# EAGLE design audioshieldproto-r2-v1 (EAGLE 5.01)
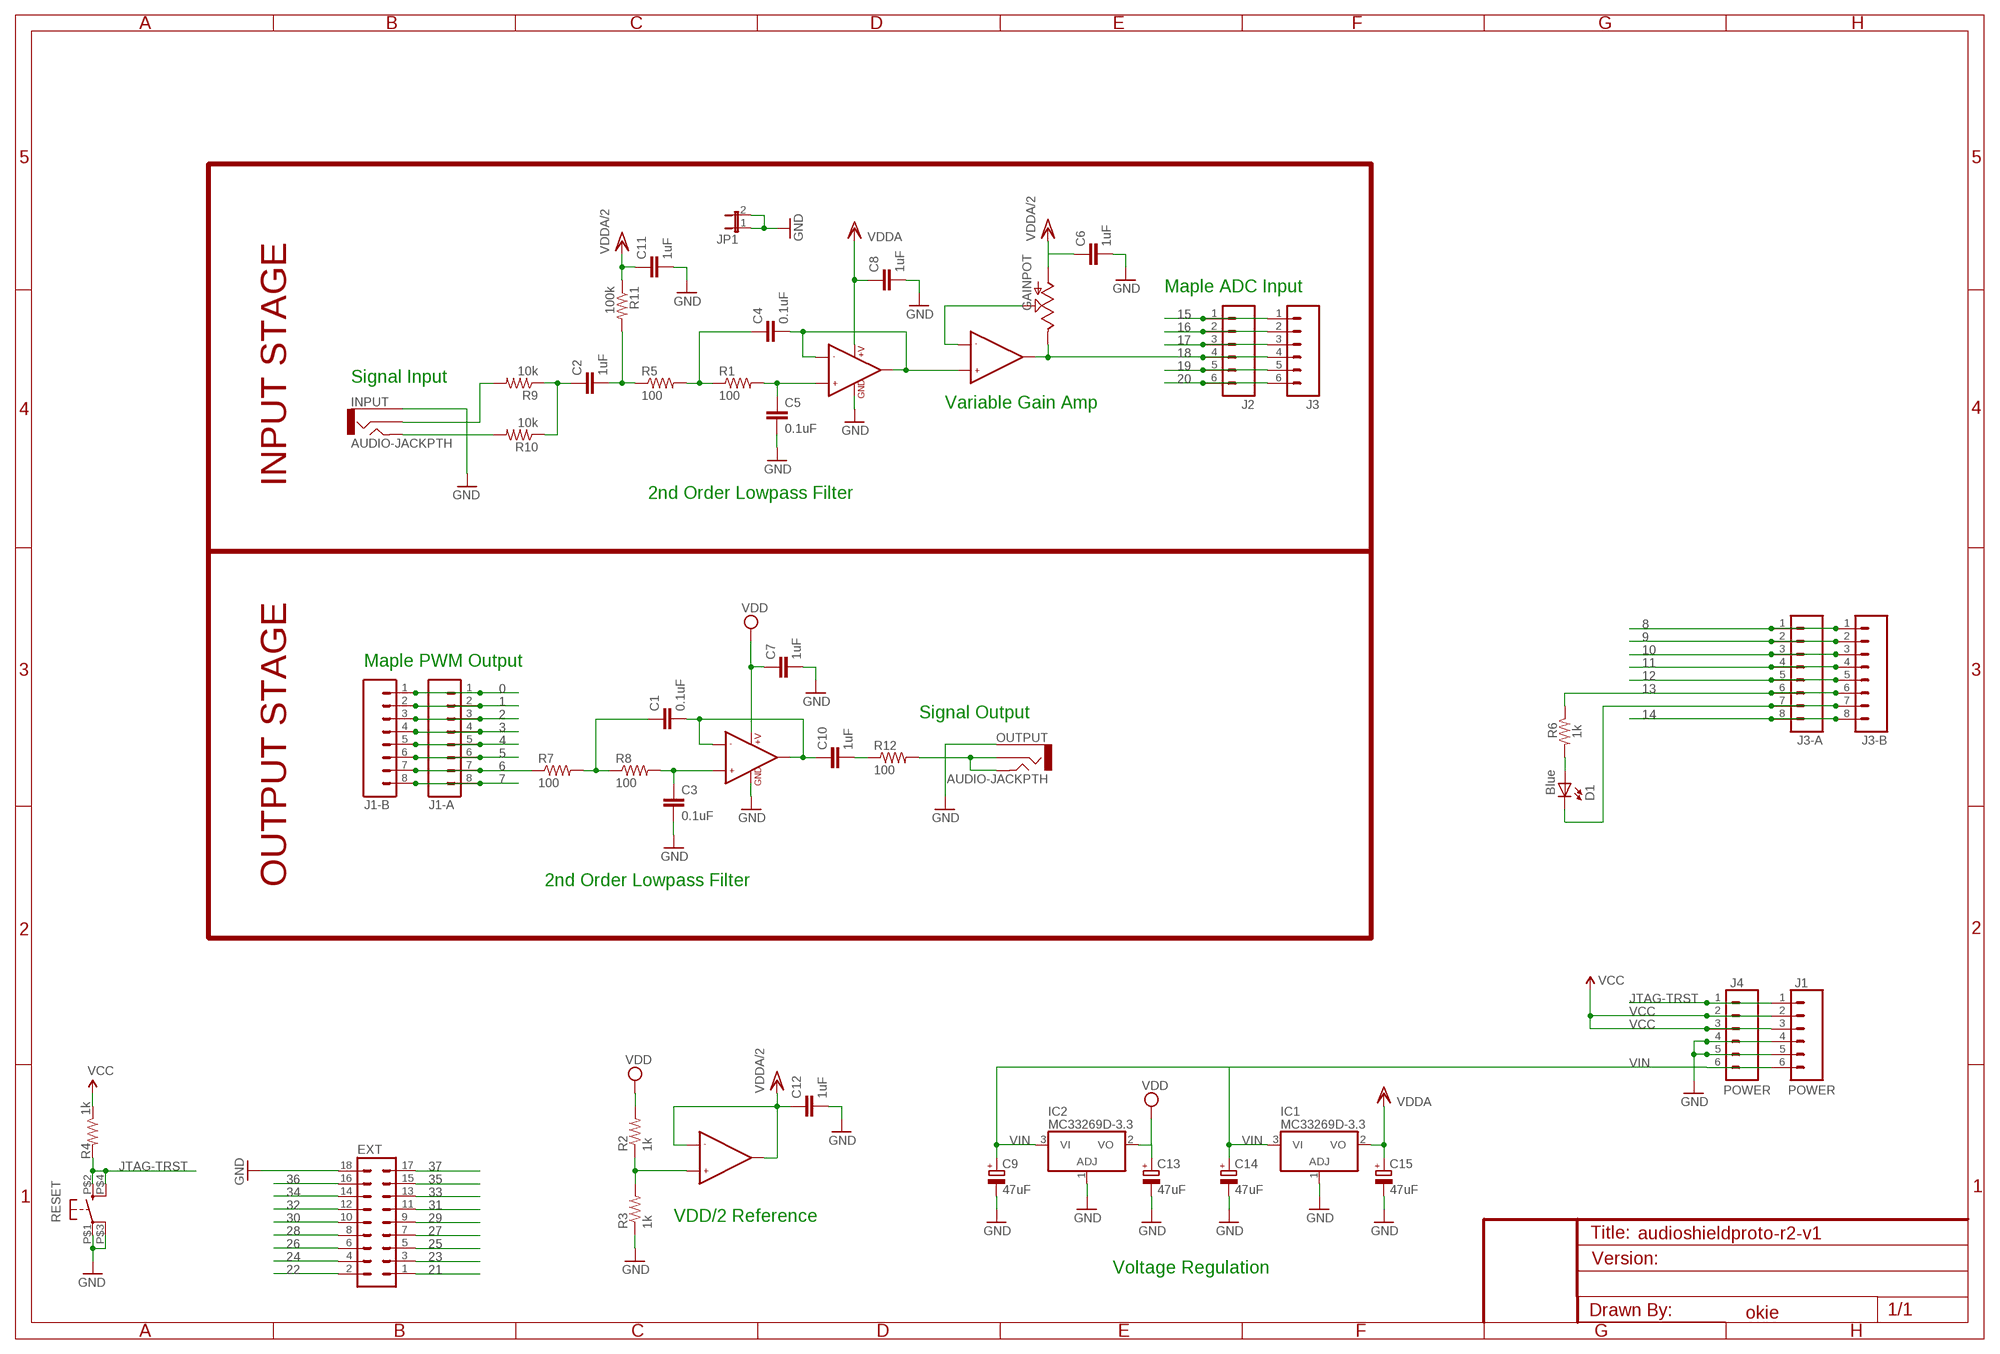
[diagram p0: schematic, sheet 1]

## Parts
C1  0.1uF  C-EUC0805  [C0805]
C2  1uF  C-EUC0805  [C0805]
C3  0.1uF  C-EUC0805  [C0805]
C4  0.1uF  C-EUC0805  [C0805]
C5  0.1uF  C-EUC0805  [C0805]
C6  1uF  C-EUC0805  [C0805]
C7  1uF  C-EUC0805  [C0805]
C8  1uF  C-EUC0805  [C0805]
C9  47uF  CPOL-EUUD-4X5,8  [UD-4X5,8_NICHICON]
C10  1uF  C-EUC0805  [C0805]
C11  1uF  C-EUC0805  [C0805]
C12  1uF  C-EUC0805  [C0805]
C13  47uF  CPOL-EUUD-4X5,8  [UD-4X5,8_NICHICON]
C14  47uF  CPOL-EUUD-4X5,8  [UD-4X5,8_NICHICON]
C15  47uF  CPOL-EUUD-4X5,8  [UD-4X5,8_NICHICON]
D1  Blue  LED0603  [LED-0603]
EXT  MA09-2  [MA09-2]
GAINPOT  POT100K  POT100K_3362U  [3362U]
IC1  MC33269D-3.3  [DPACK]
IC2  MC33269D-3.3  [DPACK]
INPUT  AUDIO-JACKPTH  [AUDIO-JACK]
J1  POWER  M06SIP  [1X06]
J1-A  M08  [1X08]
J1-B  MA08-SQUARE  [1X08-SQUARE]
J2  M06SIP  [1X06]
J3  M06SIP  [1X06]
J3-A  M08  [1X08]
J3-B  MA08-SQUARE  [1X08-SQUARE]
J4  POWER  M06SIP  [1X06]
JP1  JUMPER-2PTH_LOCK  [1X02_LOCK]
OUTPUT  AUDIO-JACKPTH  [AUDIO-JACK]
R1  100  R-US_M0805  [M0805]
R2  1k  R-US_M0805  [M0805]
R3  1k  R-US_M0805  [M0805]
R4  1k  RESISTOR0402  [C0402]
R5  100  R-US_M0805  [M0805]
R6  1k  RESISTOR0402  [C0402]
R7  100  R-US_M0805  [M0805]
R8  100  R-US_M0805  [M0805]
R9  10k  R-US_M0805  [M0805]
R10  10k  R-US_M0805  [M0805]
R11  100k  R-US_M0805  [M0805]
R12  100  R-US_M0805  [M0805]
RESET  BUTTON-KMR241GLFS  [PUSHBUTTON-KMR241GLFS]
U2  AD8542ARZ  LMV358  [SO08]
U3  AD8542ARZ  LMV358  [SO08]

## Nets
0: J1-A.1 J1-B.1
1: J1-A.2 J1-B.2
2: J1-A.3 J1-B.3
3: J1-A.4 J1-B.4
4: J1-A.5 J1-B.5
5: J1-A.6 J1-B.6
6: J1-A.7 J1-B.7 R7.1
7: J1-A.8 J1-B.8
8: J3-A.1 J3-B.1
9: J3-A.2 J3-B.2
10: J3-A.3 J3-B.3
11: J3-A.4 J3-B.4
12: J3-A.5 J3-B.5
13: J3-A.6 J3-B.6 R6.1
14: J3-A.8 J3-B.8
15: J2.1 J3.1
16: J2.2 J3.2
17: J2.3 J3.3
18: GAINPOT.P$1(E) J2.4 J3.4 U2.7(OUT2)
19: J2.5 J3.5
20: J2.6 J3.6
21: EXT.1
22: EXT.2
23: EXT.3
24: EXT.4
25: EXT.5
26: EXT.6
27: EXT.7
28: EXT.8
29: EXT.9
30: EXT.10
31: EXT.11
32: EXT.12
33: EXT.13
34: EXT.14
35: EXT.15
36: EXT.16
37: EXT.17
GND [vcc]: C3.2 C5.2 C6.2 C7.2 C8.2 C9.- C11.2 C12.2 C13.- C14.- C15.- EXT.18 IC1.1(ADJ) IC2.1(ADJ) INPUT.1 J1.4 J1.5 J4.4 J4.5 JP1.1 JP1.2 OUTPUT.1 R3.1 RESET.P$1 RESET.P$3 U2.4(GND) U3.4(GND)
JTAG-TRST: J1.1 J4.1 R4.2 RESET.P$2 RESET.P$4
N$1: C1.1 R7.2 R8.1
N$2: C2.2 R5.1 R11.2
N$3: C3.1 R8.2 U3.3(+IN1)
N$5: C1.2 C10.1 U3.1(OUT1) U3.2(-IN1)
N$6: OUTPUT.2 OUTPUT.5 R12.2
N$7: D1.A R6.2
N$8: C10.2 R12.1
N$9: C4.1 R1.1 R5.2
N$11: C5.1 R1.2 U2.3(+IN1)
N$12: GAINPOT.P$2(S) U2.6(-IN2)
N$13 [vcc]: D1.C J3-A.7 J3-B.7
N$16: INPUT.2 R9.2
N$19: INPUT.5 R10.2
N$22: R2.1 R3.2 U3.5(+IN2)
N$23: C2.1 R9.1 R10.1
N$26: C4.2 U2.1(OUT1) U2.2(-IN1) U2.5(+IN2)
VCC: J1.2 J1.3 J4.2 J4.3 R4.1
VCC/2: C6.1 C11.1 C12.1 GAINPOT.P$3(A) R11.1 U3.6(-IN2) U3.7(OUT2) ; supply symbol labelled VDDA/2
VDD: C7.1 C8.1 C13.+ C15.+ IC1.2(VO) IC2.2(VO) R2.2 U2.8(+V) U3.8(+V) ; supply symbol labelled VDDA
VIN: C9.+ C14.+ IC1.3(VI) IC2.3(VI) J1.6 J4.6

## Notes on the sheet
- Maple ADC Input
- Signal Input
- Variable Gain Amp
- INPUT STAGE
- 2nd Order Lowpass Filter
- Maple PWM Output
- Signal Output
- OUTPUT STAGE | 2nd Order Lowpass Filter
- VDD/2 Reference
- Voltage Regulation
- okie

## Library data of the parts
C1-C8 C10-C12 = rcl:C-EU: CAPACITOR, European symbol
C9 C13-C15 = rcl:CPOL-EU: POLARIZED CAPACITOR, European symbol
D1 = SparkFun:LED: LEDs Standard schematic elements and footprints for 5mm, 3mm, 1206, and 0603 sized LEDs. 5mm - Spark Fun Electronics SKU : COM-00529 (and others)
EXT = con-lstb:MA09-2: PIN HEADER
GAINPOT = SparkFun2:POT
IC1 IC2 = linear:MC33269?*: Adjustable Output Low Dropout Voltage Regulator 800 mA Source: http://www.onsemi.com/pub/Collateral/MC33269-D.PDF
INPUT OUTPUT = SparkFun2:AUDIO-JACK: 3.5mm Audio Jack Simple 3.5mm common PCB mount audio jack. SKU: PRT-08032
J1-J4 = SparkFun:M06: Header 6 Standard 6-pin 0.1" header. Use with straight break away headers (SKU : PRT-00116), right angle break away headers (PRT-00553), swiss pins (PRT-00743), machine pins (PRT-00117), and female headers (PRT-00115). Molex polarized connector foot print use with SKU : PRT-08094 with associated crimp pins and housings.
J1-A J3-A = SparkFun:M08: Header 8 Standard 8-pin 0.1" header. Use with straight break away headers (SKU : PRT-00116), right angle break away headers (PRT-00553), swiss pins (PRT-00743), machine pins (PRT-00117), and female headers (PRT-00115).
J1-B J3-B = SparkFun2:MA08-SQUARE
JP1 = SparkFun3:JUMPER-2: Jumper Basic 0.1" spaced jumper. Use with breakaway headers.
R1-R3 R5 R7-R12 = rcl:R-US_: RESISTOR, American symbol
R4 R6 = SparkFun:RESISTOR: Resistor Basic schematic elements and footprints for 0603, 1206, and PTH 1/10th watt (small) resistors.
RESET = okie:BUTTON-KMR241GLFS
U2 U3 = SparkFun2:LMV358

## Net classes
0 default: width 0.203 mm
1 vcc: width 0.254 mm
2 gnd: width 0.305 mm, drill 0.508 mm, clearance 0.152 mm
3 usbvcc: width 0.508 mm, drill 0.508 mm, clearance 0.152 mm

## Board
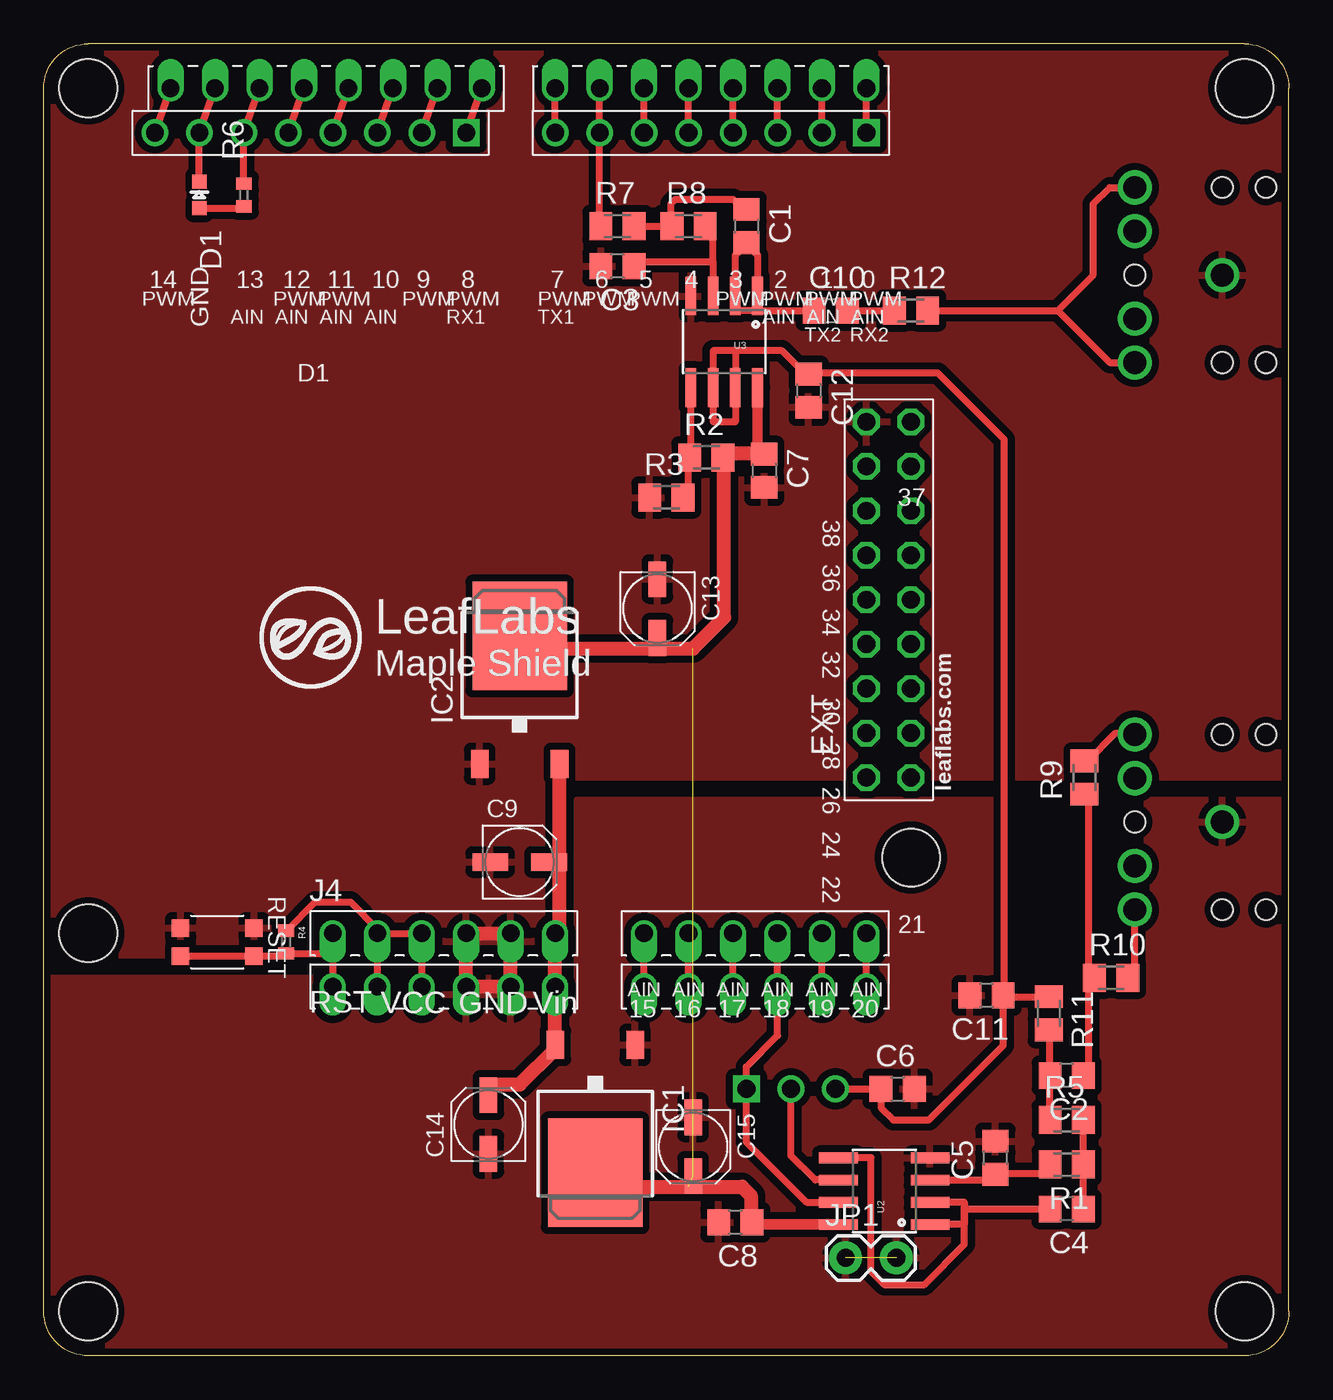
[diagram p1: board, top side]
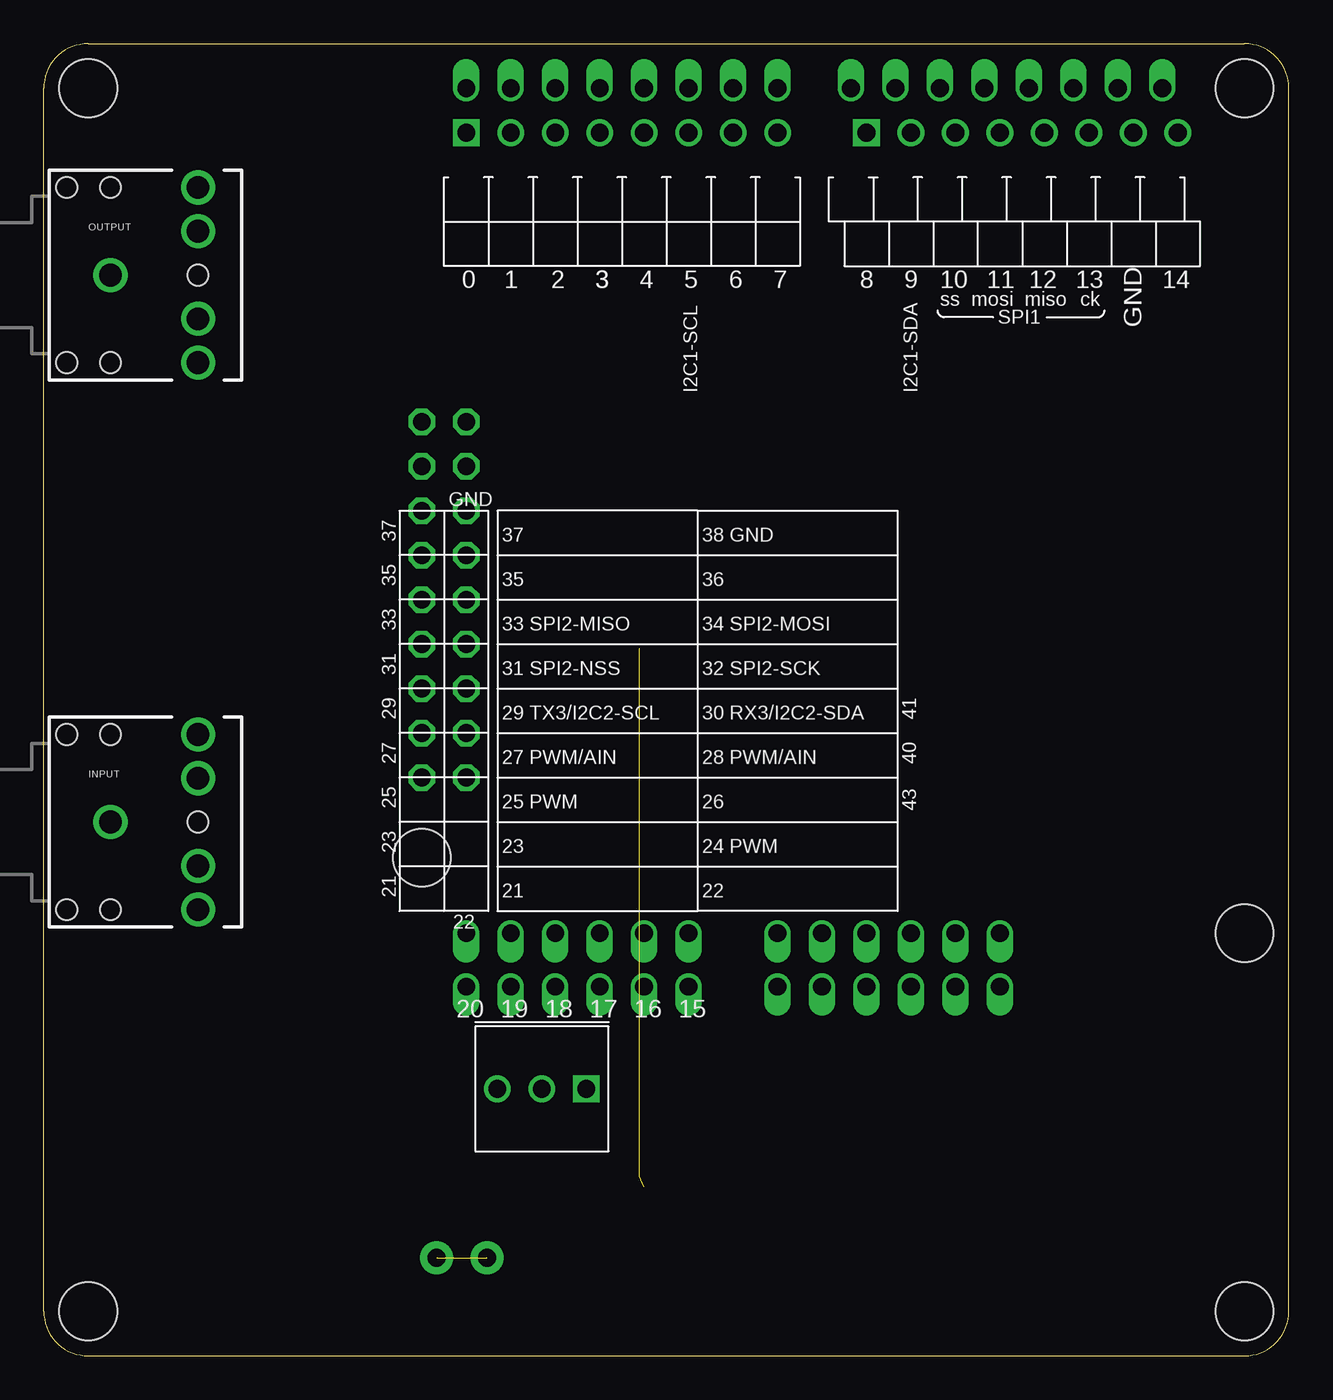
[diagram p2: board, bottom side, seen from below]

Size 71.12 x 74.93 mm. Coordinates in mm from the lower left corner, seen from the top.
Outline: 2.54,0 arc-90 0,2.54 0,72.39 arc-90 2.54,74.93 68.58,74.93 arc-90 71.12,72.39 71.12,2.54 arc-90 68.58,0 2.54,0
Copper layers (1*16): Top 0.035mm / dielectric 1.5mm / Bottom 0.035mm
Design rules "SparkFun *": minimum track width 6mil, minimum drill 15mil, track to track 6mil, track to pad 6mil, pad to pad 6mil, via to via 6mil, smd to smd 6mil, copper to edge 10mil, drill to drill 15mil, minimum pad ring 8mil, minimum via ring 6mil, stop-mask expansion 0mil, vias tented up to drill 20mil, thermal gap 16mil

### Footprints (pad centres in the part's own frame; a part is rotated, then mirrored left to right if it is on the bottom)
C0805 = smd 1.3 x 1.5: 1 -0.95,0; 2 0.95,0
UD-4X5,8_NICHICON = smd 2.032 x 1: + 1.679,0; - -1.679,0
LED-0603 = smd 0.8 x 0.8: A 0,-0.75; C 0,0.75
MA09-2 = drill 1.016 octagon: 1 -10.16,-1.27; 2 -10.16,1.27; 3 -7.62,-1.27; 4 -7.62,1.27; 5 -5.08,-1.27; 6 -5.08,1.27; 7 -2.54,-1.27; 8 -2.54,1.27; 9 0,-1.27; 10 0,1.27; 11 2.54,-1.27; 12 2.54,1.27; 13 5.08,-1.27; 14 5.08,1.27; 15 7.62,-1.27; 16 7.62,1.27; 17 10.16,-1.27; 18 10.16,1.27
3362U = drill 1.016 square: P$1 0,2.54 | drill 1.016 round: P$2 2.54,2.54; P$3 5.08,2.54
DPACK = smd 1 x 1.6: 1 -2.28,-4.8; 3 2.28,-4.8 | smd 5.4 x 6.2: 2 0,2.5
AUDIO-JACK = drill 1.3 round: 1 0,0; 2 5,5; 3 5,2.5; 4 5,-2.5; 5 5,-5 | hole 1.2: 0,5; -2.5,5; -2.5,-5; 0,-5; 5,0
1X06 = drill 1.016 offset: 1 0,0; 2 2.54,0; 3 5.08,0; 4 7.62,0; 5 10.16,0; 6 12.7,0
1X08 = drill 1.016 offset: 1 0,0; 2 2.54,0; 3 5.08,0; 4 7.62,0; 5 10.16,0; 6 12.7,0; 7 15.24,0; 8 17.78,0
1X08-SQUARE = drill 1.016 square: 1 -8.89,0 | drill 1.016 round: 2 -6.35,0; 3 -3.81,0; 4 -1.27,0; 5 1.27,0; 6 3.81,0; 7 6.35,0; 8 8.89,0
1X02_LOCK = drill 1.016 pad 1.88 round: 1 -0.178,0; 2 2.718,0
M0805 = smd 1.3 x 1.6: 1 -0.95,0; 2 0.95,0
C0402 = smd 0.7 x 0.9: 1 -0.65,0; 2 0.65,0
PUSHBUTTON-KMR241GLFS = smd 1 x 1: P$1 2.1,0.8; P$2 2.1,-0.8; P$3 -2.1,0.8; P$4 -2.1,-0.8
SO08 = smd 0.61 x 2.21: 1 -1.905,-2.616; 2 -0.635,-2.616; 3 0.635,-2.616; 4 1.905,-2.616; 5 1.905,2.616; 6 0.635,2.616; 7 -0.635,2.616; 8 -1.905,2.616
STAND-OFF = hole 3.302: 0,0

### Placement (x,y rotation side)
C1  40.13,64.52 270 top
C2  58.42,16 180 top
C3  32.77,62.23 180 top
C4  58.42,8.38 180 top
C5  54.36,11.3 90 top
C6  48.77,15.24 0 top
C7  41.15,50.55 270 top
C8  39.5,7.62 180 top
C9  27.18,28.19 0 top
C10  44.96,59.69 0 top
C11  53.85,20.57 180 top
C12  43.69,55.12 270 top
C13  35.05,42.67 270 top
C14  25.4,13.21 90 top
C15  37.08,11.94 270 top
D1  8.89,66.29 0 top
EXT  48.26,43.18 90 top
GAINPOT  40.13,17.78 180 bottom
IC1  31.5,12.95 180 top
IC2  27.18,38.61 0 top
INPUT  67.31,30.48 0 bottom
J1  16.51,21.08 0 top
J1-A  46.99,72.39 180 top
J1-B  38.1,69.85 180 top
J2  34.29,24.13 0 top
J3  34.29,21.08 0 top
J3-A  25.02,72.39 180 top
J3-B  15.24,69.85 180 top
J4  16.51,24.13 0 top
JP1  45.97,5.59 0 top
OUTPUT  67.31,61.72 0 bottom
R1  58.42,10.92 180 top
R2  37.85,51.31 0 top
R3  35.56,49.02 0 top
R4  13.84,23.62 270 top
R5  58.42,13.46 0 top
R6  11.43,66.29 270 top
R7  32.77,64.52 0 top
R8  36.83,64.52 0 top
R9  59.44,33.02 90 top
R10  60.96,21.59 0 top
R11  57.4,19.56 270 top
R12  49.53,59.69 0 top
RESET  9.91,23.62 0 top
U2  48.01,9.4 90 top
U3  38.86,57.91 180 top
U$1  STAND-OFF  [STAND-OFF]  2.54,24.13 0 top
U$2  STAND-OFF  [STAND-OFF]  2.54,2.54 0 top
U$3  STAND-OFF  [STAND-OFF]  68.58,2.54 0 top
U$4  STAND-OFF  [STAND-OFF]  2.54,72.39 0 top
U$5  STAND-OFF  [STAND-OFF]  68.58,72.39 0 top
U$10  STAND-OFF  [STAND-OFF]  49.53,28.45 0 top

### Tracks (layer width: path | path; a pad name or v marks a point on that pad's centre or on a via)
0
  Top 0.406: J1-B.1 J1-A.1
1
  Top 0.406: J1-B.2 J1-A.2
2
  Top 0.406: J1-B.3 J1-A.3
3
  Top 0.406: J1-B.4 J1-A.4
4
  Top 0.406: J1-B.5 J1-A.5
5
  Top 0.406: J1-B.6 J1-A.6
6
  Top 0.406: J1-A.7 J1-B.7 31.75,64.52 R7.1
7
  Top 0.406: J1-B.8 J1-A.8
8
  Top 0.406: J3-B.1 J3-A.1
9
  Top 0.406: J3-B.2 J3-A.2
10
  Top 0.406: J3-B.3 J3-A.3
11
  Top 0.406: J3-B.4 J3-A.4
12
  Top 0.406: J3-B.5 J3-A.5
13
  Top 0.406: J3-A.6 J3-B.6 R6.1
14
  Top 0.406: J3-B.8 J3-A.8
15
  Top 0.406: J3.1 J2.1
16
  Top 0.406: J3.2 J2.2
17
  Top 0.406: J3.3 J2.3
18
  Top 0.406: J2.4 J3.4 41.91,18.29 40.13,16.51 GAINPOT.P$1 40.13,12.19 43.56,8.76 U2.7
19
  Top 0.406: J3.5 J2.5
20
  Top 0.406: 46.99,20.07 J3.6 J2.6
GND  (1 unrouted)
  Top 0.813: J1.4 24.13,20.57 | J1.4 J4.4 | J1.5 26.67,20.57 | J1.5 26.67,24.38 | J1.4 J1.5 | 23.88,24.13 26.92,24.13
  pour Top (isolate 0.406): 29.21,22.86 0,22.86 0,74.93 71.12,74.93 71.12,33.02 29.21,33.02
  pour Top (isolate 0.406): 0,21.59 30.48,21.59 30.48,31.75 71.12,31.75 71.12,0 0,0
JTAG-TRST
  Top 0.406: 11.94,22.82 RESET.P$2 13.72,22.82 13.72,22.97 R4.2 16.11,22.97 16.51,23.37 J4.1 J1.1 | RESET.P$4 11.94,22.82 | 11.94,22.82 11.94,22.86
N$1
  Top 0.406: R7.2 R8.1 35.81,64.58 35.81,65.79 36.07,66.04 39.37,66.04 39.94,65.47 C1.1
N$2
  Top 0.406: R5.1 57.47,15.68 57.15,16 C2.2 57.47,18.22 57.4,18.29 R11.2
N$3
  Top 0.406: R8.2 38.1,64.52 38.23,64.39 38.23,62.48 | 38.23,62.48 U3.3 | C3.1 34.22,62.48 38.23,62.48
N$4
  Top 0.406: 38.35,53.34 39.37,53.34
N$5
  Top 0.406: U3.2 39.5,62.87 40.13,63.5 | 40.13,63.5 C1.2 | 40.13,63.5 40.77,62.87 U3.1 40.77,59.69 | 40.77,59.69 39.62,59.69 | 40.77,59.69 C10.1
N$6
  Top 0.406: R12.2 57.91,59.69 | OUTPUT.5 60.88,56.72 57.91,59.69 | OUTPUT.2 60.88,66.72 59.94,65.79 59.94,61.72 57.91,59.69
N$7
  Top 0.406: D1.A 11.32,65.53 R6.2
N$8
  Top 0.406: C10.2 R12.1
N$9
  Top 0.406: R5.2 59.69,13.46 59.37,13.14 R1.1 59.37,8.7 59.44,8.64 59.37,8.57 C4.1
N$11
  Top 0.406: R1.2 56.96,10.41 54.8,10.41 C5.1 54.36,10.16 54.23,10.03 U2.3
N$12
  Top 0.406: U2.6 44.07,10.03 42.67,11.43 GAINPOT.P$2
N$13
  Top 0.406: J3-A.7 J3-B.7 D1.C
N$16
  Top 0.406: INPUT.2 62.23,35.56 61.21,35.56 59.62,33.97 R9.2
N$19
  Top 0.406: INPUT.5 62.31,21.59 R10.2
N$22
  Top 0.406: U3.5 36.96,51.44 arc-90 36.83,51.31 R2.1 arc90 36.83,51.24 36.83,49.09 arc-90 R3.2
N$23
  Top 0.406: R10.1 59.69,21.59 59.69,16 C2.1 | R10.1 60.01,21.78 59.94,21.84 60.01,21.91 | R10.1 59.76,21.84 59.69,21.84 59.69,31.82 R9.1
N$26
  Top 0.406: U2.1 52.58,7.49 52.58,8.38 | 52.58,8.76 52.58,8.38 | 52.58,8.38 C4.2 | U2.5 47.24,11.3 47.24,4.83 48.01,4.06 50.29,4.06 52.58,6.35 52.58,8.76 | 52.58,8.76 U2.2
VCC
  Top 0.406: R4.1 13.86,24.27 15.49,25.91 17.53,25.91 19.05,24.38 J4.2 | J4.2 J4.3 J1.3 | J4.2 J1.2
VCC/2
  Top 0.406: GAINPOT.P$3 C6.1 47.82,14.16 48.51,13.46 50.55,13.46 54.8,17.71 C11.1 54.86,20.57 | R11.1 54.93,20.51 54.86,20.57 | 38.23,53.34 U3.6 38.23,57.4 39.5,57.4 | 39.5,53.34 U3.7 39.5,57.4 | 54.86,20.57 54.86,52.32 51.05,56.13 43.69,56.13 C12.1 43.5,56.07 42.16,57.4 39.5,57.4
VDD  (2 unrouted)
  Top 0.406: 40.39,7.62 40.51,7.49 | 38.86,51.31 39.12,51.56
  Top 0.61: U3.8 40.77,51.56 40.89,51.56 | 31.5,10.41 31.5,9.65 | C8.1 40.64,7.62 40.77,7.49 U2.8
  Top 0.813: C7.1 41.15,51.56 40.89,51.56 39.12,51.56 | IC1.2 31.5,10.41 32,9.91 32.51,9.91 32.77,9.65 36.83,9.65 39.88,9.65 40.39,9.14 40.39,7.62 C8.1 | IC2.2 27.9,40.39 35.05,40.39 | 35.05,40.39 C13.+ | 35.05,40.39 37.08,40.39 38.86,42.16 38.86,51.31 R2.2
VIN
  Top 0.406: J4.6 J1.6
  Top 0.813: IC1.3 29.21,18.03 | 29.21,18.03 J4.6 arc90 29.46,24.38 29.46,28.19 | 29.21,18.03 29.22,18.03 IC1.3 | 29.46,28.19 C9.+ | IC2.3 29.46,28.19 | C14.+ 25.4,15.24 arc-90 25.65,15.49 27.18,15.49 29.22,17.53 IC1.3

### Text on the board
tPlace: 14 | GND | 13 | 12 | 11 | 10 | 9 | 8 | 7 | 6 | 5 | 4 | 3 | 2 | 1 | 0 | PWM | PWM | PWM | PWM | PWM | PWM | PWM | PWM | PWM | PWM | PWM | PWM | AIN | AIN | AIN | AIN | RX1 | TX1 | AIN | AIN | AIN | TX2 | RX2 | D1 | 37 | 38 | 36 | 34 | LeafLabs | 32 | Maple Shield | 30 | 28 | 26 | leaflabs.com | 24 | 22 | 21 | AIN | AIN | AIN | AIN | AIN | AIN | RST | VCC | GND | Vin | 15 | 16 | 17 | 18 | 19 | 20
bPlace: GND | 14 | 13 | 12 | 11 | 10 | 9 | 8 | 7 | 6 | 5 | 4 | 3 | 3 | 2 | 1 | 0 | ck | miso | mosi | ss | SPI1 | I2C1-SDA | I2C1-SCL | GND | 37 | 38 GND | 37 | 35 | 36 | 35 | 33 | 34 SPI2-MOSI | 33 SPI2-MISO | 31 | 32 SPI2-SCK | 31 SPI2-NSS | 41 | 29 | 30 RX3/I2C2-SDA | 29 TX3/I2C2-SCL | 40 | 27 | 28 PWM/AIN | 27 PWM/AIN | 25 | 43 | 26 | 25 PWM | 23 | 24 PWM | 23 | 21 | 22 | 21 | 22 | 15 | 16 | 17 | 18 | 19 | 20
tValues: DNP | DNP | DNP | DNP